# EAGLE design BR81_MKL_3032_21MTC_J0_003_01_06 (EAGLE 5.10)

## Sheet 1 of 2
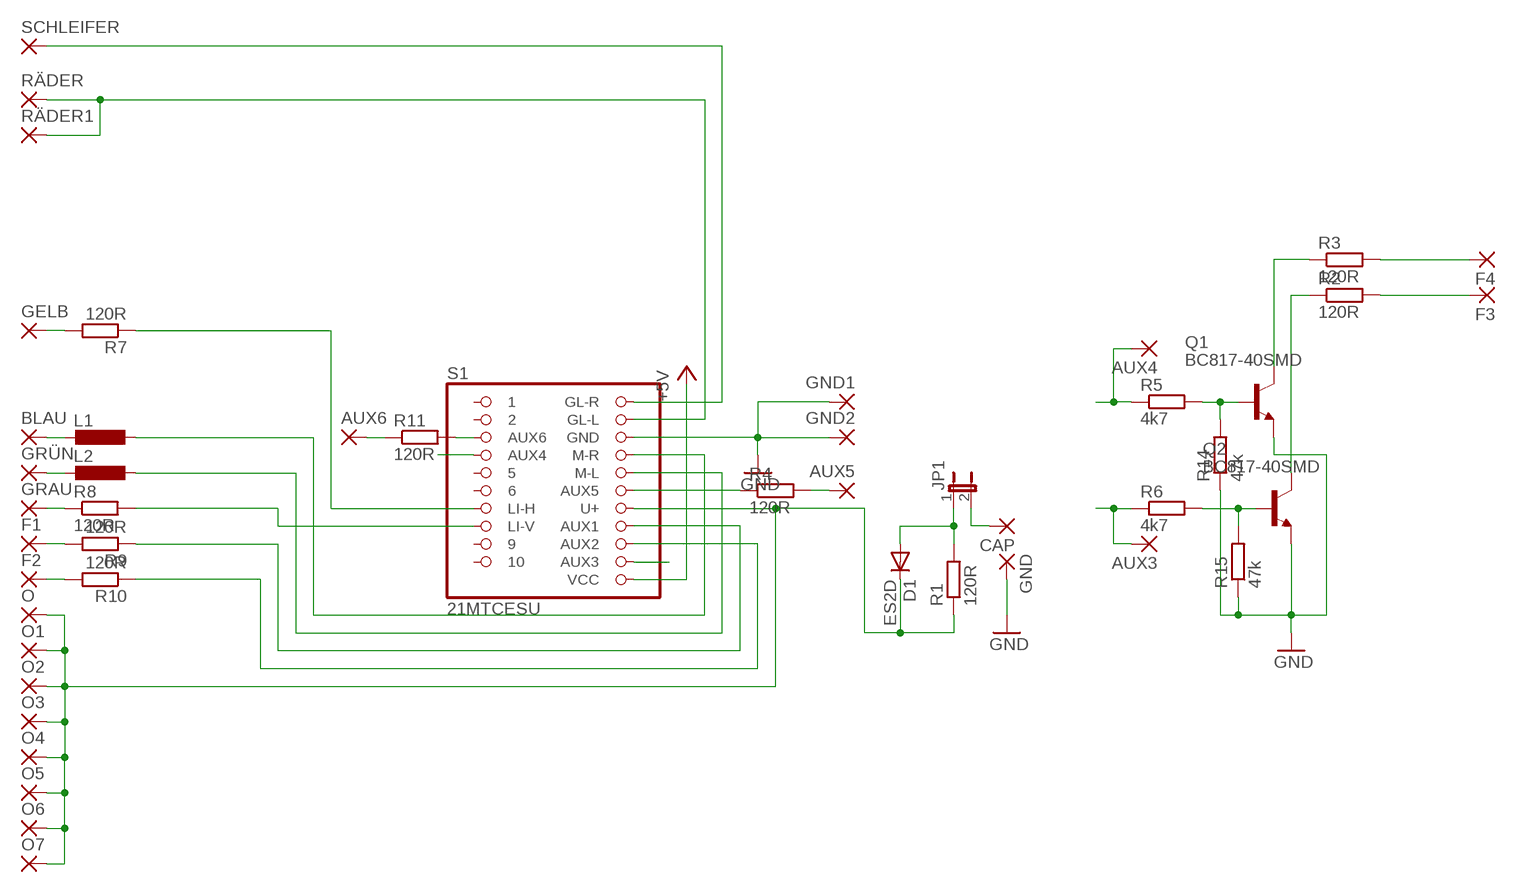
[diagram p0: schematic, sheet 1]

### Parts
AUX3  SMD2  [SMD1,27-2,54]
AUX4  SMD2  [SMD1,27-2,54]
AUX5  SMD2  [SMD1,27-2,54]
AUX6  SMD2  [SMD1,27-2,54]
BLAU  SMD2  [SMD1,27-2,54]
CAP  SMD2  [SMD1,27-2,54]
D1  ES2D  [SMB]
F1  SMD2  [SMD1,27-2,54]
F2  SMD2  [SMD1,27-2,54]
F3  SMD2  [SMD1,27-2,54]
F4  SMD2  [SMD1,27-2,54]
GELB  SMD2  [SMD1,27-2,54]
GND  SMD2  [SMD1,27-2,54]
GND1  SMD2  [SMD1,27-2,54]
GND2  SMD2  [SMD1,27-2,54]
GRAU  SMD2  [SMD1,27-2,54]
GRÜN  SMD2  [SMD1,27-2,54]
JP1  JP1E2,00  [JP1_2]
L1  L-EUL1212  [L1212]
L2  L-EUL1212  [L1212]
O  SMD2  [SMD1,27-2,54]
O1  SMD2  [SMD1,27-2,54]
O2  SMD2  [SMD1,27-2,54]
O3  SMD2  [SMD1,27-2,54]
O4  SMD2  [SMD1,27-2,54]
O5  SMD2  [SMD1,27-2,54]
O6  SMD2  [SMD1,27-2,54]
O7  SMD2  [SMD1,27-2,54]
Q1  BC817-40SMD  [SOT23-BEC]
Q2  BC817-40SMD  [SOT23-BEC]
R1  120R  R-EU_R0603S  [R0603S]
R2  120R  R-EU_R0603S  [R0603S]
R3  120R  R-EU_R0603S  [R0603S]
R4  120R  R-EU_R0603S  [R0603S]
R5  4k7  R-EU_R0603  [R0603]
R6  4k7  R-EU_R0603  [R0603]
R7  120R  R-EU_R0603S  [R0603S]
R8  120R  R-EU_R0603S  [R0603S]
R9  120R  R-EU_R0603S  [R0603S]
R10  120R  R-EU_R0603S  [R0603S]
R11  120R  R-EU_R0603S  [R0603S]
R14  47k  R-EU_R0603  [R0603]
R15  47k  R-EU_R0603  [R0603]
RÄDER  SMD2  [SMD1,27-2,54]
RÄDER1  SMD2  [SMD1,27-2,54]
S1  21MTCESU  [21MTC_SMD_ESU]
SCHLEIFER  SMD2  [SMD1,27-2,54]

### Nets
+5V: S1.P12(VCC)
AUX3: AUX3.1(P) R6.1 S1.P13(AUX3)
AUX4: AUX4.1(P) R5.1 S1.P4(AUX4)
AUX5: R4.1 S1.P17(AUX5)
AUX6: R11.2 S1.P3(AUX6)
BLAU: L1.1 S1.P19(M-R)
CAP: D1.A JP1.1 R1.2
F1: R9.1 S1.P15(AUX1)
F2: R10.1 S1.P14(AUX2)
F3: F3.1(P) R2.2
F4: F4.1(P) R3.2
GELB: R7.1 S1.P7(LI-H)
GND: GND1.1(P) GND2.1(P) GND.1(P) Q1.E Q2.E R14.1 R15.1 S1.P20(GND)
GRAU: R8.2 S1.P8(LI-V)
GRÜN: L2.1 S1.P18(M-L)
N$1: CAP.1(P) JP1.2
N$2: AUX6.1(P) R11.1
N$3: F1.1(P) R9.2
N$4: AUX5.1(P) R4.2
N$5: Q2.C R2.1
N$6: Q1.C R3.1
N$7: Q1.B R5.2 R14.2
N$8: Q2.B R6.2 R15.2
N$9: GELB.1(P) R7.2
N$10: GRAU.1(P) R8.1
N$11: F2.1(P) R10.2
N$14: GRÜN.1(P) L2.2
N$15: BLAU.1(P) L1.2
ORANGE: D1.C O1.1(P) O2.1(P) O3.1(P) O4.1(P) O5.1(P) O6.1(P) O7.1(P) O.1(P) R1.1 S1.P16(U+)
RÄDER: RÄDER1.1(P) RÄDER.1(P) S1.P21(GL-L)
SCHLEIFER: S1.P22(GL-R) SCHLEIFER.1(P)
Unconnected: S1.P1 S1.P2 S1.P5 S1.P6 S1.P9 S1.P10

## Sheet 2 of 2

## Library data of the parts
AUX3-AUX6 BLAU CAP F1-F4 GELB GND GND1 GND2 GRAU GRÜN O O1-O7 RÄDER RÄDER1 SCHLEIFER = wirepad:SMD2: SMD PAD
D1 = diode:ES2D: DIODE super fast rectifier, 2 A
JP1 = jumper:JP1E: JUMPER
L1 L2 = rcl:L-EU: INDUCTOR, European symbol
Q1 Q2 = transistor-npn:BC817*: NPN Transistor
R1-R11 R14 R15 = rcl:R-EU_: RESISTOR, European symbol
S1 = pinhead:21MTC

## Board
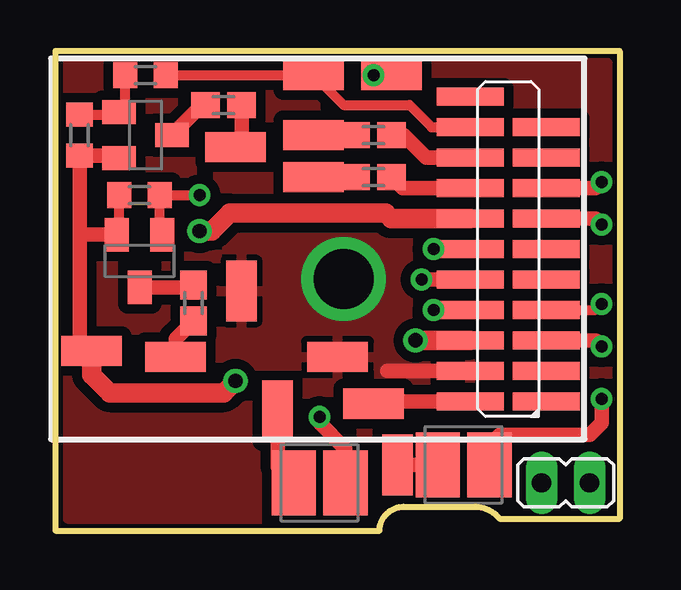
[diagram p1: board, top side]
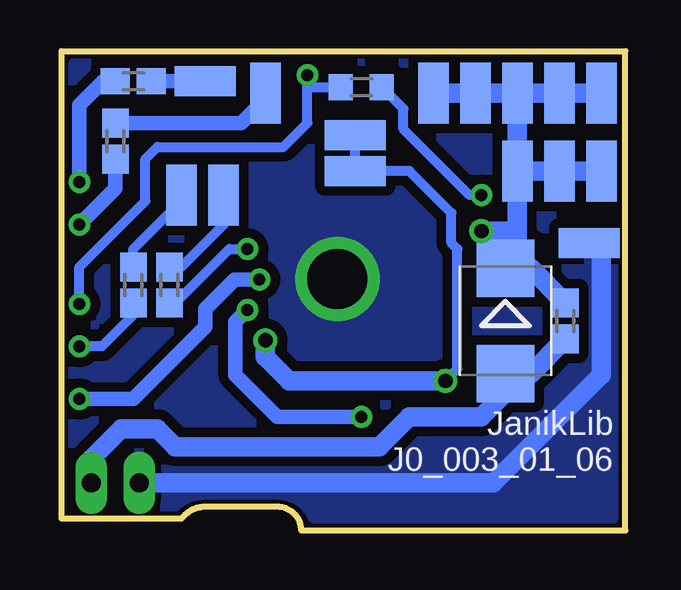
[diagram p2: board, bottom side, seen from below]

No outline drawn. Coordinates in mm, seen from the top.
Copper layers (1*16): Top 0.035mm / dielectric 1.5mm / Bottom 0.035mm
Design rules "default *": minimum track width 10mil, minimum drill 0.6mm, track to track 8mil, track to pad 8mil, pad to pad 8mil, via to via 8mil, smd to smd 8mil, copper to edge 40mil, drill to drill 8mil, minimum pad ring 10mil, minimum via ring 8mil, stop-mask expansion 4mil, vias tented up to drill 0mil, thermal gap 10mil
Milling: 8 lines

### Footprints (pad centres in the part's own frame; a part is rotated, then mirrored left to right if it is on the bottom)
SMD1,27-2,54 = smd 1.27 x 2.54: 1 0,0
SMB = smd 2.4 x 2.4: A 2.2,0; C -2.2,0
JP1_2 = drill 0.8 long: 1 0,-1; 2 0,1
L1212 = smd 1.85 x 2.7: 1 -1.075,0; 2 1.075,0
SOT23-BEC = smd 1 x 1.4: B -0.95,-1.1; C 0,1.1; E 0.95,-1.1
R0603S = smd 1.2 x 1.1: 1 -0.75,0; 2 0.75,0
R0603 = smd 1 x 1.1: 1 -0.85,0; 2 0.85,0
21MTC_SMD_ESU = smd 0.75 x 2.8: P1 -6.35,-0.953; P2 -5.08,-0.953; P3 -3.81,-0.953; P4 -2.54,-0.953; P5 -1.27,-0.953; P6 0,-0.953; P7 1.27,-0.953; P8 2.54,-0.953; P9 3.81,-0.953; P10 5.08,-0.953; P12 6.35,2.223; P13 5.08,2.223; P14 3.81,2.223; P15 2.54,2.223; P16 1.27,2.223; P17 0,2.223; P18 -1.27,2.223; P19 -2.54,2.223; P20 -3.81,2.223; P21 -5.08,2.223; P22 -6.35,2.223

### Placement (x,y rotation side)
AUX3  10.75,19 270 top
AUX4  14,19 90 top
AUX5  16.75,14 180 bottom
AUX6  18.5,14 180 bottom
BLAU  9.25,5 180 top
CAP  1.5,12 270 bottom
D1  5,8.75 270 bottom
F1  10.75,14.75 270 top
F2  10.75,16.5 270 top
F3  7.5,16 270 top
F4  5,7.25 90 top
GELB  15,18.25 0 bottom
GND  1.5,7.5 270 top
GND1  11.25,15 270 bottom
GND2  11.25,16.5 90 bottom
GRAU  17.5,18.75 270 bottom
GRÜN  14.25,2.75 180 top
JP1  21.25,2 90 top
L1  11,2 180 top
L2  17,2.75 180 top
O  1,18.25 0 bottom
O1  2.75,18.25 0 bottom
O2  4.5,18.25 180 bottom
O3  6.25,18.25 180 bottom
O4  8,18.25 0 bottom
O5  1,15 0 bottom
O6  2.75,15 0 bottom
O7  4.5,15 0 bottom
Q1  3.5,11.25 180 top
Q2  3.75,16.5 270 top
R1  2.5,8.75 270 bottom
R2  7,17.75 0 top
R3  5.75,9.5 270 top
R4  19,10.25 90 bottom
R5  11,18.5 0 bottom
R6  3.75,19 180 top
R7  21.25,16.25 90 bottom
R8  20.5,18.75 180 bottom
R9  13.25,14.75 180 top
R10  13.25,16.5 180 top
R11  20.5,10.25 270 bottom
R14  3.5,14 0 top
R15  1,16.5 90 top
RÄDER  7.75,10 180 top
RÄDER1  11.75,7.25 90 top
S1  19.5,11.75 90 top
SCHLEIFER  13.25,5.3 270 top

### Tracks (layer width: path | path; a pad name or v marks a point on that pad's centre or on a via)
AUX3
  Top 0.406: R6.1 AUX3.1 12,17.75 14.75,17.75 15.67,16.83 S1.P13
AUX4  (via drill 0.5)
  Top 0.406: S1.P4 22.5,9.21 v22.75,9.46 | v13.25,19 AUX4.1
  Bottom 0.406: v22.75,9.46 22.75,11 20,13.75 20,15.5 19.5,16 14.25,16 13.25,17 13.25,18.5 | 13.25,18.5 v13.25,19 | 13.25,18.5 R5.1
AUX5  (via drill 0.5)
  Top 0.61: v15.75,11.75 S1.P17
  Bottom 0.406: v15.75,11.75 16.5,11.75 18.75,9.5 R4.1
AUX6  (via drill 0.5)
  Top 0.61: S1.P3 22.5,7.94 v22.75,7.69
  Bottom 0.406: v22.75,7.69 21.81,7.69 20.5,9 R11.2
BLAU  (via drill 0.5)
  Top 0.61: v15.75,9.21 S1.P19 | v11,4.75 11,4.5 12.07,3.42 L1.1
  Bottom 0.61: v11,4.75 14.5,4.75 16.25,6.5 16.25,8.71 v15.75,9.21
CAP
  Bottom 0.813: JP1.1 22.25,3 21,4.25 19.5,4.25 18.75,3.5 10.25,3.5 9,4.75 6,4.75 5,5.75 D1.A 3.95,6.55 R1.2
F1
  Top 0.61: S1.P15 14.46,14.29 R9.1
F2
  Top 0.61: S1.P14 15.44,15.56 14.5,16.5 R10.1
F3
  Top 0.61: R2.2 7.75,16.25 F3.1
F4
  Top 0.61: R3.2 5,8 F4.1
GELB  (via drill 0.5)
  Top 0.61: S1.P7 22.5,13.02 v22.75,12.77
  Bottom 0.61: R7.1 21.25,14.27 v22.75,12.77
GND  (via drill 0.6)
  Top 0.406: R14.1 2.65,12.45 Q1.E
  Top 0.61: GND.1 1,7.5 1,12.35 | Q2.E 2.55,15.65 R15.1 1,12.35 | 1,12.35 Q1.E
  Top 0.813: v15,7.94 S1.P20 | GND.1 1.5,6.5 2.25,5.75 7,5.75 v7.5,6.25
  Bottom 0.406: v7.5,6.25 7,6.75 7,11.75 7.25,12 7.25,13.25 9,15 GND1.1 GND2.1
  Bottom 0.813: v15,7.94 15,7.25 14,6.25 v7.5,6.25
GRAU  (via drill 0.5)
  Top 0.61: S1.P8 22.5,14.29 v22.75,14.54
  Bottom 0.61: v22.75,14.54 22.75,17.75 21.75,18.75 R8.2
GRÜN  (via drill 0.5)
  Top 0.61: v15.25,10.48 S1.P18 | L2.1 18.07,3.58 18.5,4 22.25,4 22.75,4.5 v22.75,5.5
  Bottom 0.61: v15.25,10.48 16.27,10.48 17.5,9.25 17.5,8.5 20.5,5.5 v22.75,5.5
N$1
  Bottom 0.813: CAP.1 1,11.5 1,6.5 5.5,2 JP1.2
  pour Bottom (isolate 0.406): 0.5,12.25 0.5,0.5 13,0.5 arc-67 14.5,1.5 17.5,1.5 arc-44 18.75,1 20.5,1 20.5,3.5 10.25,3.5 9.75,4 5.75,4 2.5,7.25 2.5,12.25
N$2
  Bottom 0.406: R11.1 20.5,11.75 18.5,13.75 AUX6.1
N$3
  Top 0.61: R9.2 F1.1
N$4
  Bottom 0.406: AUX5.1 16.75,12.75 18.5,11 R4.2
N$5
  Top 0.61: Q2.C 6.1,17.75 R2.1
N$6
  Top 0.61: Q1.C 5.65,10.15 R3.1
N$7  (via drill 0.5)
  Top 0.406: v6,14 R14.2 4.35,12.45 Q1.B
  Bottom 0.406: v6,14 6.5,14 9.25,16.75 9.25,17.6 R5.2
N$8
  Top 0.406: R6.2 2.9,17.7 Q2.B 2.8,17.35 R15.2
N$9
  Bottom 0.61: GELB.1 15,18 16,17 R7.2
N$10
  Bottom 0.61: GRAU.1 R8.1
N$11
  Top 0.61: R10.2 F2.1
N$14
  Top 0.61: GRÜN.1 L2.2
N$15
  Top 0.61: L1.2 9.25,2.67 BLAU.1
ORANGE  (via drill 0.6)
  Top 0.813: S1.P16 13.98,13.02 13.75,13.25 7.25,13.25 6.5,12.5 v6,12.5
  Bottom 0.813: O.1 O1.1 O2.1 | O4.1 O3.1 O2.1 | O5.1 O6.1 O7.1 | 4.5,12.5 v6,12.5 | 4.5,12.5 4.5,11.45 D1.C 3.95,10.95 R1.1 | O7.1 O2.1 | 4.5,12.5 O7.1
RÄDER  (via drill 2.5)
  Top 0.61: 13.83,6.67 S1.P21
  other vias: 12,10.5
  pour Top (isolate 0.406): 23,19.5 0.5,19.5 0.5,0.5 13,0.5 13,1.5 19,1.5 19,1 23,1
  pour Bottom (isolate 0.406, rank 2): 23,19.5 0.5,19.5 0.5,13 2.5,13 2.5,7.25 5.75,4 9.75,4 10.25,3.5 20.5,3.5 20.5,1 23,1
SCHLEIFER
  Top 0.61: S1.P22 13.6,5.4 SCHLEIFER.1

### Text on the board
bNames: JanikLib | J0_003_01_06
tStop: BR81 BR260 | 3032 / 30321 | Für Märklin: | 3064 / 3065
bStop: design by Janik Merz